# EAGLE design gopro (EAGLE 5.11)
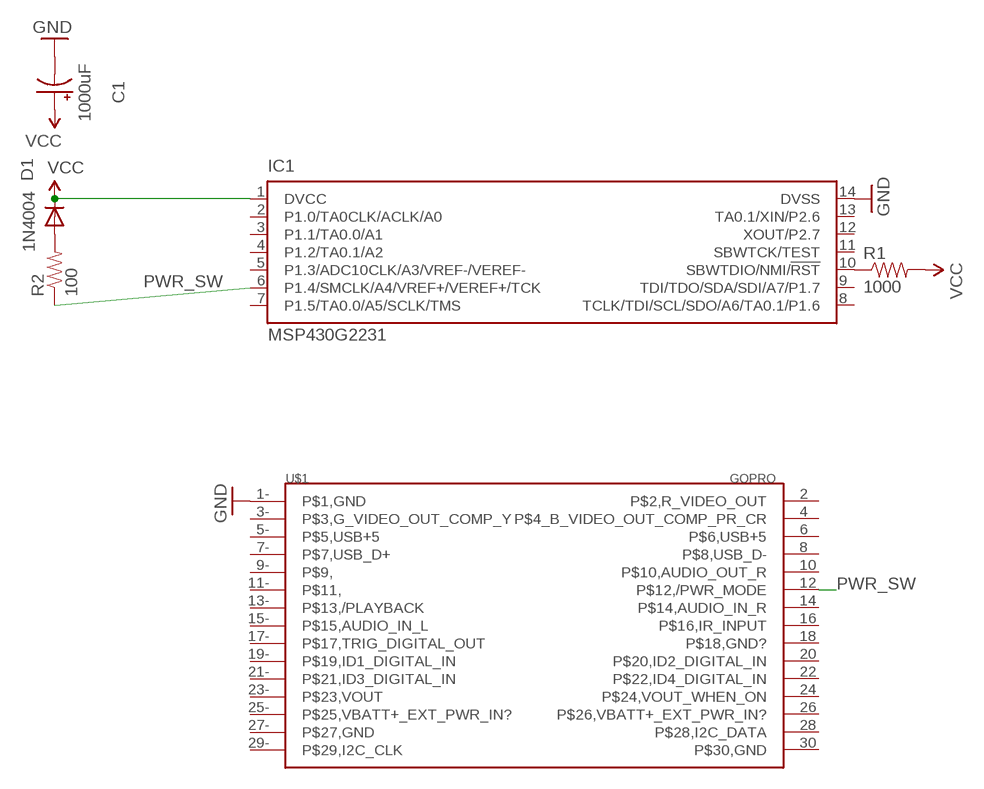
[diagram p0: schematic, sheet 1]

## Parts
C1  1000uF  CAP_POLPTH1  [CPOL-RADIAL-100UF-25V]
D1  1N4004  [DO41-10]
IC1  MSP430G2231  [DIP14]
R1  1000  RESISTORPTH-1/4W  [AXIAL-0.4]
R2  100  RESISTORPTH-1/4W  [AXIAL-0.4]
U$1  GOPRO  [GOPRO_MALE]

## Nets
GND: C1.2(-) IC1.14(DVSS) U$1.1-(P$1,GND)
N$1: D1.A R2.P$2
N$2: IC1.10(SBWTDIO/NMI/!RST) R1.P$1
PWR_SW: IC1.6(P1.4/SMCLK/A4/VREF+/VEREF+/TCK) R2.P$1 U$1.12(P$12,/PWR_MODE)
VCC: C1.1(+) D1.C IC1.1(DVCC) R1.P$2
Unconnected: IC1.2(P1.0/TA0CLK/ACLK/A0) IC1.3(P1.1/TA0.0/A1) IC1.4(P1.2/TA0.1/A2) IC1.5(P1.3/ADC10CLK/A3/VREF-/VEREF-) IC1.7(P1.5/TA0.0/A5/SCLK/TMS) IC1.8(TCLK/TDI/SCL/SDO/A6/TA0.1/P1.6) IC1.9(TDI/TDO/SDA/SDI/A7/P1.7) IC1.11(SBWTCK/TEST) IC1.12(XOUT/P2.7) IC1.13(TA0.1/XIN/P2.6) U$1.2(P$2,R_VIDEO_OUT) U$1.3-(P$3,G_VIDEO_OUT_COMP_Y) U$1.4(P$4_B_VIDEO_OUT_COMP_PR_CR) U$1.5-(P$5,USB+5) U$1.6(P$6,USB+5) U$1.7-(P$7,USB_D+) U$1.8(P$8,USB_D-) U$1.9-(P$9,) U$1.10(P$10,AUDIO_OUT_R) U$1.11-(P$11,) U$1.13-(P$13,/PLAYBACK) U$1.14(P$14,AUDIO_IN_R) U$1.15-(P$15,AUDIO_IN_L) U$1.16(P$16,IR_INPUT) U$1.17-(P$17,TRIG_DIGITAL_OUT) U$1.18(P$18,GND?) U$1.19-(P$19,ID1_DIGITAL_IN) U$1.20(P$20,ID2_DIGITAL_IN) U$1.21-(P$21,ID3_DIGITAL_IN) U$1.22(P$22,ID4_DIGITAL_IN) U$1.23-(P$23,VOUT) U$1.24(P$24,VOUT_WHEN_ON) U$1.25-(P$25,VBATT+_EXT_PWR_IN?) U$1.26(P$26,VBATT+_EXT_PWR_IN?) U$1.27-(P$27,GND) U$1.28(P$28,I2C_DATA) U$1.29-(P$29,I2C_CLK) U$1.30(P$30,GND)

## Library data of the parts
C1 = SparkFun:CAP_POL: Capacitor Polarized These are standard SMD and PTH capacitors. Normally 10uF, 47uF, and 100uF in electrolytic and tantalum varieties. Always verify the external diameter of the through hole cap, it varies with capacity, voltage, and manufacturer. The EIA devices should be standard.
D1 = adafruit:1N4004: DIODE General purpose 1N400x type rectifier (With bigger pads) http://www.ladyada.net/library/pcb/eaglelibrary.html
IC1 = dp_devices:MSP430G2231: Ultra Low Power Mixed signal microcontroller
R1 R2 = SparkFun:RESISTOR: Resistor Basic schematic elements and footprints for 0603, 1206, and PTH resistors.
U$1 = SparkFun:GOPRO: Go Pro based on the male iphone connector sold by Sparkfun

## Board
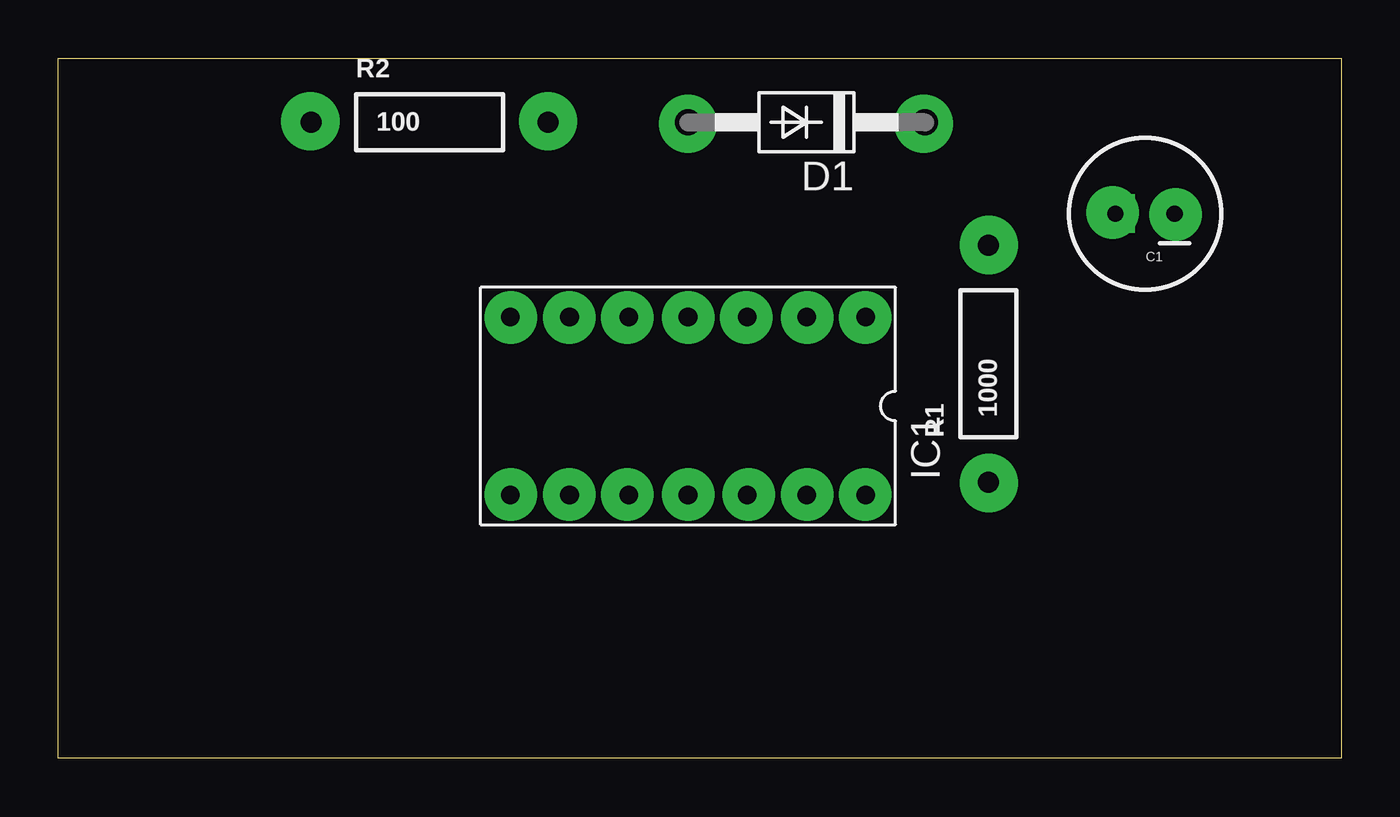
[diagram p1: board, top side]
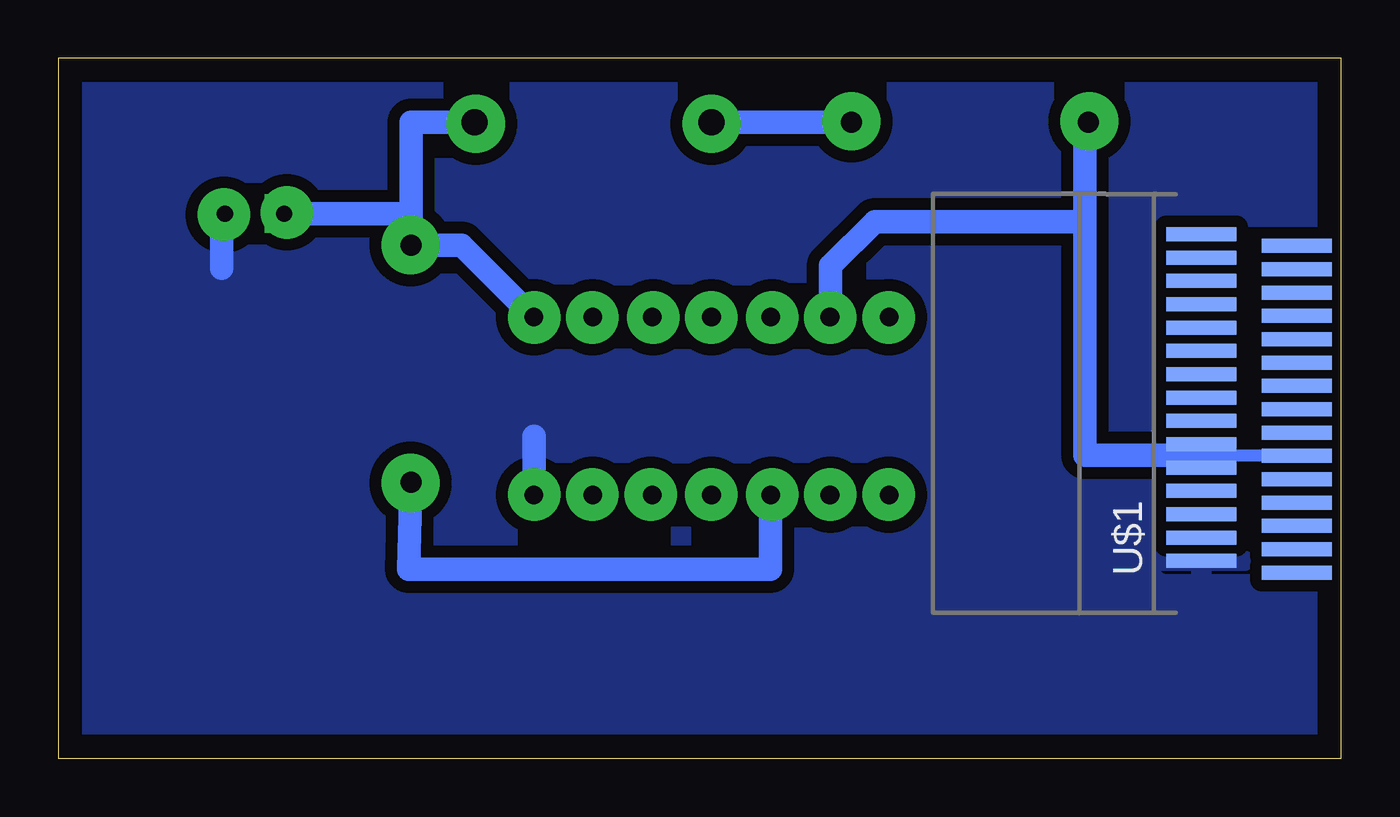
[diagram p2: board, bottom side, seen from below]

Size 55 x 30 mm. Coordinates in mm from the lower left corner, seen from the top.
Outline: 0,0 0,30 55,30 55,0 0,0
Copper layers (1*16): Top 0.035mm / dielectric 1.5mm / Bottom 0.035mm
Design rules "default *": minimum track width 40mil, minimum drill 24mil, track to track 20mil, track to pad 20mil, pad to pad 20mil, via to via 20mil, smd to smd 20mil, copper to edge 40mil, drill to drill 8mil, minimum pad ring 10mil, minimum via ring 8mil, stop-mask expansion 4mil, vias tented up to drill 0mil, thermal gap 10mil

### Footprints (pad centres in the part's own frame; a part is rotated, then mirrored left to right if it is on the bottom)
CPOL-RADIAL-100UF-25V = drill 0.7 pad 1.651 square: 1 1.27,0 | drill 0.7 pad 1.651 round: 2 -1.27,0
DO41-10 = drill 1.118 pad 1.93 round: A 5.08,0; C -5.08,0
DIP14 = drill 0.8 square: 1 -7.62,-3.81 | drill 0.8 round: 2 -5.08,-3.81; 3 -2.54,-3.81; 4 0,-3.81; 5 2.54,-3.81; 6 5.08,-3.81; 7 7.62,-3.81; 8 7.62,3.81; 9 5.08,3.81; 10 2.54,3.81; 11 0,3.81; 12 -2.54,3.81; 13 -5.08,3.81; 14 -7.62,3.81
AXIAL-0.4 = drill 0.9 pad 1.88 round: P$1 -5.08,0; P$2 5.08,0
GOPRO_MALE = smd 0.6 x 3: 1- -7,0; 2 -7.5,-4.1; 3- -6,0; 4 -6.5,-4.1; 5- -5,0; 6 -5.5,-4.1; 7- -4,0; 8 -4.5,-4.1; 9- -3,0; 10 -3.5,-4.1; 11- -2,0; 12 -2.5,-4.1; 13- -1,0; 14 -1.5,-4.1; 15- 0,0; 16 -0.5,-4.1; 17- 1,0; 18 0.5,-4.1; 19- 2,0; 20 1.5,-4.1; 21- 3,0; 22 2.5,-4.1; 23- 4,0; 24 3.5,-4.1; 25- 5,0; 26 4.5,-4.1; 27- 6,0; 28 5.5,-4.1; 29- 7,0; 30 6.5,-4.1

### Placement (x,y rotation side)
C1  46.59,23.34 180 top
D1  32.08,27.26 180 top
IC1  27,15.1 180 top
R1  39.88,16.92 90 top
R2  15.92,27.26 0 top
U$1  6,15.46 90 bottom

### Tracks (layer width: path | path; a pad name or v marks a point on that pad's centre or on a via)
GND
  Bottom 1.016: C1.2 arc-90 48,23.2 48,21 | IC1.14 34.6,11.29 34.6,13.8
  pour Bottom: -4,33 59,33 59,-4 -4,-4
N$1
  Bottom 1.016: R2.P$2 D1.A
N$2
  Bottom 1.016: IC1.10 24.46,8.1 39.98,8.1 R1.P$1
N$3  (via drill 0.1 pad 2.5)
  other vias: 10.8,27.3
N$4  (via drill 0.1 pad 2.5)
  other vias: 21,27.3
N$5  (via drill 0.1 pad 2.5)
  other vias: 27,27.2
N$6  (via drill 0.1 pad 2.5)
  other vias: 37.1,27.2
N$7  (via drill 0.1 pad 2.25)
  other vias: 45.2,23.4
N$8  (via drill 0.1 pad 2.25)
  other vias: 47.9,23.3
N$9  (via drill 0.1 pad 2.25)
  other vias: 34.6,11.3
N$10  (via drill 0.1 pad 2.25)
  other vias: 32.1,11.3
N$11  (via drill 0.1 pad 2.25)
  other vias: 29.6,11.3
N$12  (via drill 0.1 pad 2.25)
  other vias: 27,11.3
N$13  (via drill 0.1 pad 2.25)
  other vias: 24.4,11.3
N$14  (via drill 0.1 pad 2.25)
  other vias: 21.9,11.3
N$15  (via drill 0.1 pad 2.25)
  other vias: 19.4,11.3
N$16  (via drill 0.1 pad 2.25)
  other vias: 19.4,18.9
N$17  (via drill 0.1 pad 2)
  other vias: 37.1,27.3
N$18  (via drill 0.1 pad 2.5)
  other vias: 39.9,22
N$19  (via drill 0.1 pad 2.5)
  other vias: 39.9,11.8
N$20  (via drill 0.1 pad 2.25)
  other vias: 21.9,18.9
N$21  (via drill 0.1 pad 2.25)
  other vias: 24.4,18.9
N$22
  pour Bottom: -1,31 56,31 56,0 0,-1
N$23  (via drill 0.1 pad 2.25)
  other vias: 27,18.9
N$24  (via drill 0.1 pad 2.25)
  other vias: 29.5,18.9
N$25  (via drill 0.1 pad 2.25)
  other vias: 32.1,18.9
N$26  (via drill 0.1 pad 2.25)
  other vias: 34.6,18.9
PWR_SW
  Bottom 0.508: U$1.12 5,12.96 5,13
  Bottom 1.016: IC1.6 21.9,19 21.9,21.1 20,23 11,23 | R2.P$1 10.9,27 11,26.9 11,23 | 5,13 11,13 11,23
VCC
  Bottom 1.016: D1.C 39.88,27.26 R1.P$2 | R1.P$2 39.88,23.34 C1.1 | IC1.1 37.71,22 R1.P$2